# Altium schematic sheet backplane_main.SchDoc: Sample Sheet Title
size B; Date: MM/DD/YYYY; Author: Sample Author; Organization: ORGANIZATION; Address1: ADDRESS 1; Address2: ADDRESS 2; Address3: ADDRESS 3; Address4: ADDRESS 4; Revision: -; SheetNumber: 1; SheetTotal: 3; ENG_APP_DATE: --/--/--; DSN_APP_DATE: --/--/--; CHK_APP_DATE: --/--/--
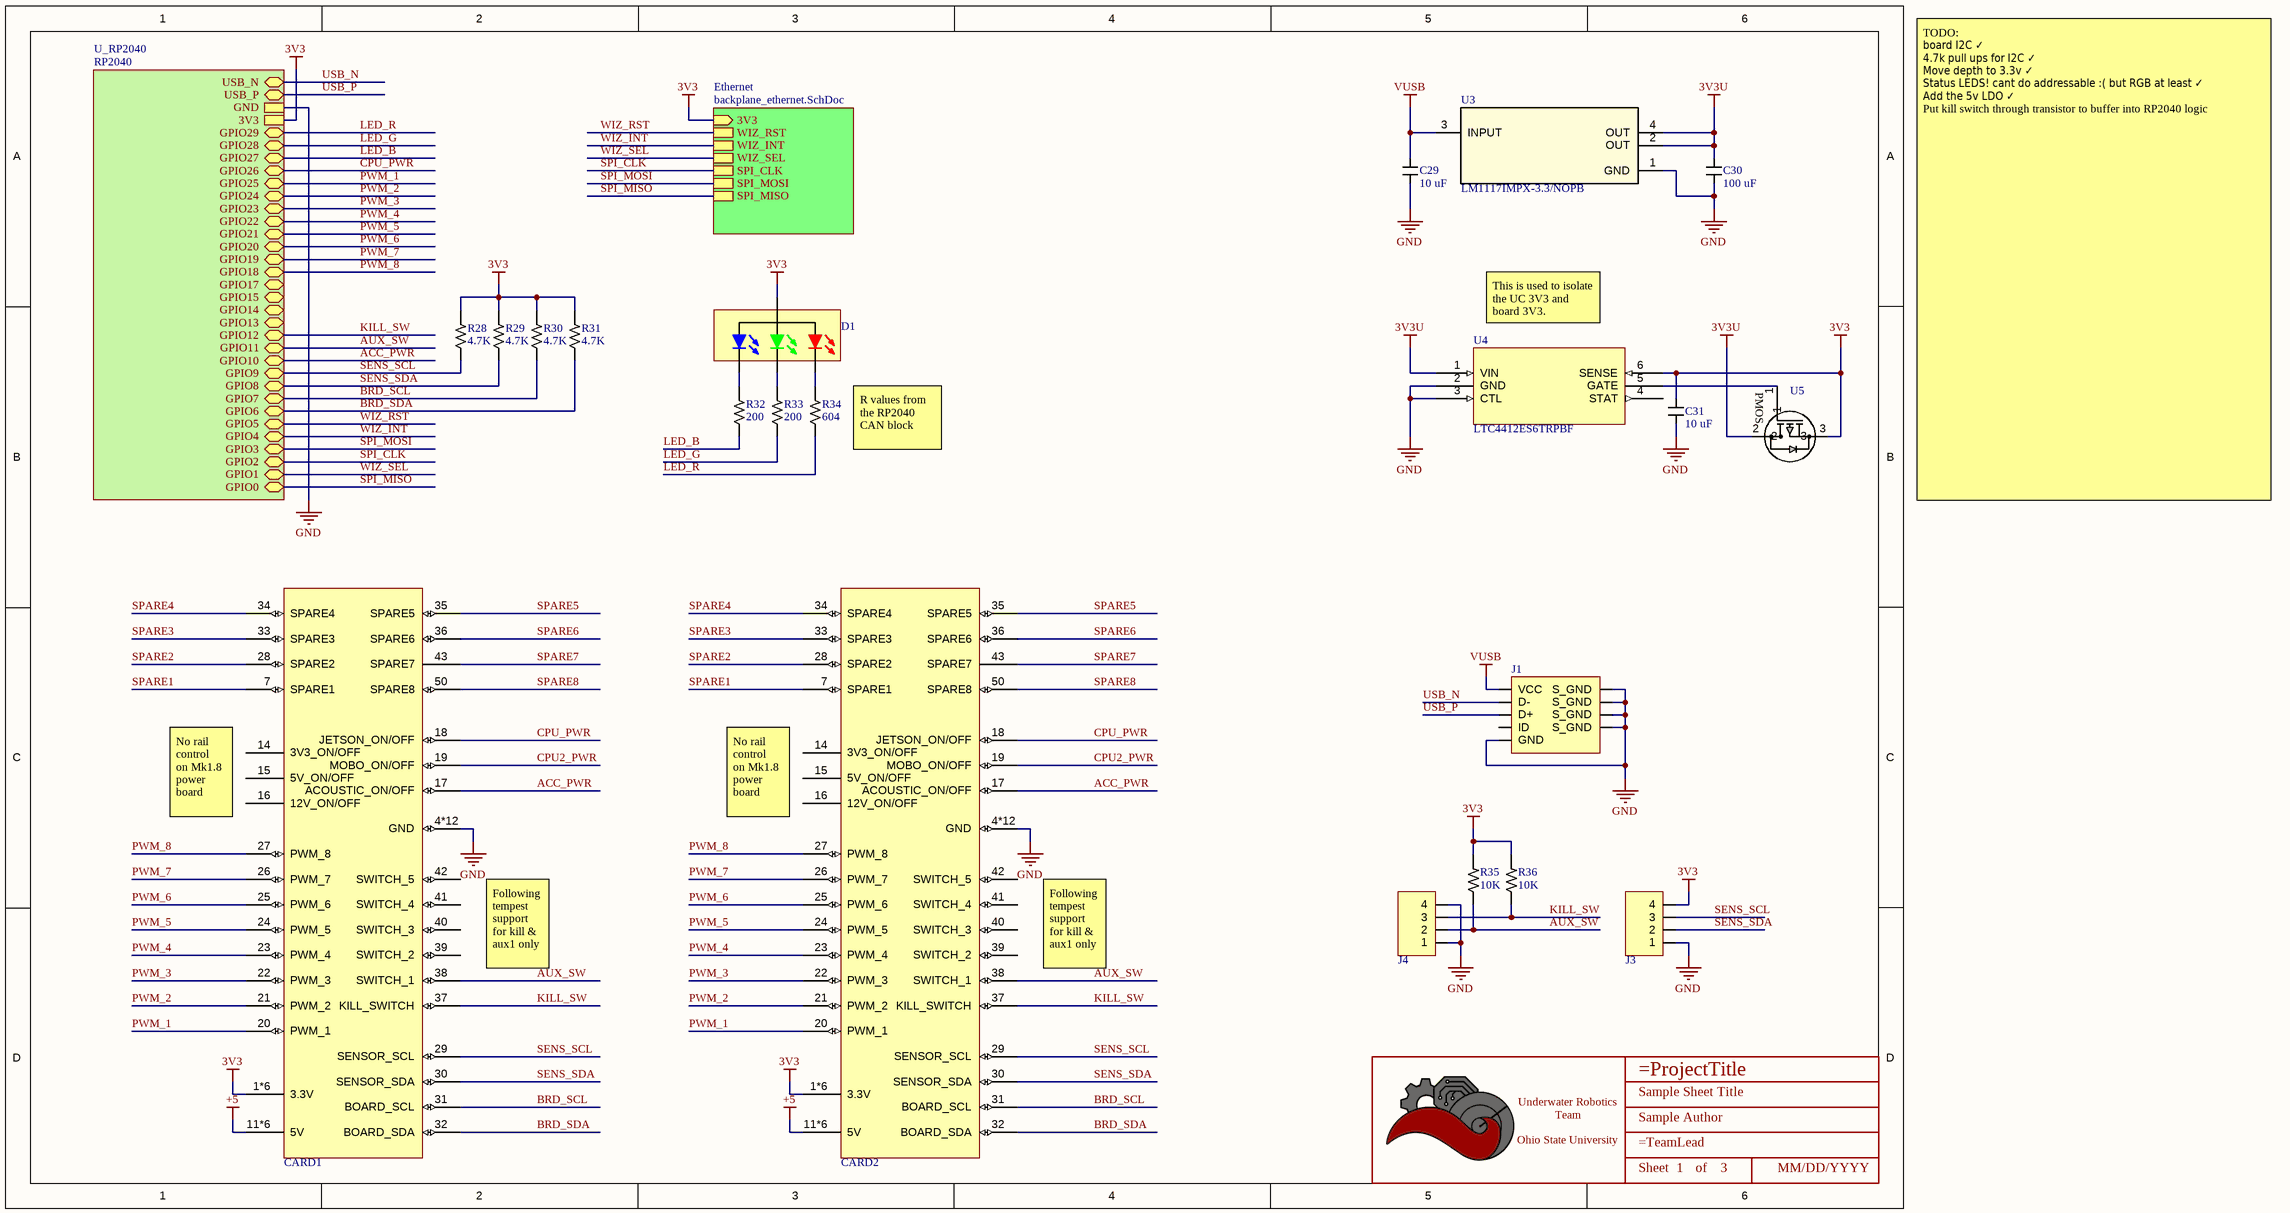
[diagram p0: backplane_main.SchDoc]

## Parts
*  Title_Block  [LOGO]  (value not drawn)  (graphical)
C29  Value (uF): 10 uF  [CAPACITOR_0603]  (hidden comment: 10uF Ceramic 6.3V)
C30  Value (uF): 100 uF  [CAPACITOR_0603]  (hidden comment: 100uF Ceramic 6.3V)
C31  Value (uF): 10 uF  [CAPACITOR_0603]  (hidden comment: 10uF Ceramic 6.3V)
CARD1  BACKPLANE_EDGE_SOCKET  [SOCKET_BACKPLANE_EDGE_CONN]  (value not drawn)
CARD2  BACKPLANE_EDGE_SOCKET  [SOCKET_BACKPLANE_EDGE_CONN]  (value not drawn)
D1  EAST1616RGBB4  [LED_0606_4SMD]  (value not drawn)
J1  USB_MICRO R/A  [CONN_MINIUSB]  (value not drawn)
J3  4 POS R/A  [CONN_MOLEX_MINIFIT JR_4 POS_R/A]  (value not drawn)
J4  4 POS R/A  [CONN_MOLEX_MINIFIT JR_4 POS_R/A]  (value not drawn)
R28  Value  (Ohms): 4.7K  [RESISTOR_0603]  (hidden comment: 10k Ohm 5% 1/10W)
R29  Value  (Ohms): 4.7K  [RESISTOR_0603]  (hidden comment: 10k Ohm 5% 1/10W)
R30  Value  (Ohms): 4.7K  [RESISTOR_0603]  (hidden comment: 10k Ohm 5% 1/10W)
R31  Value  (Ohms): 4.7K  [RESISTOR_0603]  (hidden comment: 10k Ohm 5% 1/10W)
R32  Value  (Ohms): 200  [RESISTOR_0603]  (hidden comment: 10k Ohm 5% 1/10W)
R33  Value  (Ohms): 200  [RESISTOR_0603]  (hidden comment: 10k Ohm 5% 1/10W)
R34  Value  (Ohms): 604  [RESISTOR_0603]  (hidden comment: 10k Ohm 5% 1/10W)
R35  Value  (Ohms): 10K  [RESISTOR_0603]  (hidden comment: 10k Ohm 5% 1/10W)
R36  Value  (Ohms): 10K  [RESISTOR_0603]  (hidden comment: 10k Ohm 5% 1/10W)
U3  LM1117IMPX-3.3/NOPB  [SOT-223-4]
U4  LTC4412ES6TRPBF  [TSOT-23_S6]
U5  MOSFET P-CHANNEL 20V 4.7A SOT23  [SOT-23-3]  (value not drawn)

## Sub-sheets
Ethernet = backplane_ethernet.SchDoc: WIZ_RST, WIZ_INT, WIZ_SEL, SPI_CLK, SPI_MOSI, SPI_MISO, 3V3 (in)
U_RP2040 = RP2040: GPIO0 (bidir), GPIO1 (bidir), GPIO2 (bidir), GPIO3 (bidir), GPIO4 (bidir), GPIO5 (bidir), GPIO6 (bidir), GPIO7 (bidir), GPIO8 (bidir), GPIO9 (bidir), GPIO10 (bidir), GPIO11 (bidir), GPIO12 (bidir), GPIO13 (bidir), GPIO14 (bidir), GPIO15 (bidir), GPIO17 (bidir), GPIO18 (bidir), GPIO19 (bidir), GPIO20 (bidir), GPIO21 (bidir), GPIO22 (bidir), GPIO23 (bidir), GPIO24 (bidir), GPIO25 (bidir), GPIO26 (bidir), GPIO27 (bidir), GPIO28 (bidir), GPIO29 (bidir), 3V3, GND, USB_P (bidir), USB_N (bidir)

## Nets
3V3: C31.1 CARD1.1*6(3.3V) CARD2.1*6(3.3V) D1.4 J3.4 R28.1 R29.1 R30.1 R31.1 R35.1 R36.1 U4.6(SENSE) U5.3 ; sheet U_RP2040/3V3, sheet Ethernet/3V3
3V3U: C30.1 U3.2(OUT) U3.4(OUT) U4.1(VIN) U5.2
+5: CARD1.11*6(5V) CARD2.11*6(5V)
GND: C29.2 C30.2 C31.2 CARD1.4*12(GND) CARD2.4*12(GND) J1.5(GND) J1.6(S_GND) J1.7(S_GND) J1.8(S_GND) J1.9(S_GND) J3.1 J4.1 J4.4 U3.1(GND) U4.2(GND) U4.3(CTL) ; sheet U_RP2040/GND
VUSB: C29.1 J1.1(VCC) U3.3(INPUT)
ACC_PWR: CARD1.17(ACOUSTIC_ON/OFF) CARD2.17(ACOUSTIC_ON/OFF) ; sheet U_RP2040/GPIO10
AUX_SW: CARD1.38(SWITCH_1) CARD2.38(SWITCH_1) J4.2 R35.2 ; sheet U_RP2040/GPIO11
BRD_SCL: CARD1.31(BOARD_SCL) CARD2.31(BOARD_SCL) R30.2 ; sheet U_RP2040/GPIO7
BRD_SDA: CARD1.32(BOARD_SDA) CARD2.32(BOARD_SDA) R31.2 ; sheet U_RP2040/GPIO6
CPU2_PWR: CARD1.19(MOBO_ON/OFF) CARD2.19(MOBO_ON/OFF)
CPU_PWR: CARD1.18(JETSON_ON/OFF) CARD2.18(JETSON_ON/OFF) ; sheet U_RP2040/GPIO26
KILL_SW: CARD1.37(KILL_SWITCH) CARD2.37(KILL_SWITCH) J4.3 R36.2 ; sheet U_RP2040/GPIO12
LED_B: R32.2 ; sheet U_RP2040/GPIO27
LED_G: R33.2 ; sheet U_RP2040/GPIO28
LED_R: R34.2 ; sheet U_RP2040/GPIO29
PWM_1: CARD1.20(PWM_1) CARD2.20(PWM_1) ; sheet U_RP2040/GPIO25
PWM_2: CARD1.21(PWM_2) CARD2.21(PWM_2) ; sheet U_RP2040/GPIO24
PWM_3: CARD1.22(PWM_3) CARD2.22(PWM_3) ; sheet U_RP2040/GPIO23
PWM_4: CARD1.23(PWM_4) CARD2.23(PWM_4) ; sheet U_RP2040/GPIO22
PWM_5: CARD1.24(PWM_5) CARD2.24(PWM_5) ; sheet U_RP2040/GPIO21
PWM_6: CARD1.25(PWM_6) CARD2.25(PWM_6) ; sheet U_RP2040/GPIO20
PWM_7: CARD1.26(PWM_7) CARD2.26(PWM_7) ; sheet U_RP2040/GPIO19
PWM_8: CARD1.27(PWM_8) CARD2.27(PWM_8) ; sheet U_RP2040/GPIO18
SENS_SCL: CARD1.29(SENSOR_SCL) CARD2.29(SENSOR_SCL) J3.3 R28.2 ; sheet U_RP2040/GPIO9
SENS_SDA: CARD1.30(SENSOR_SDA) CARD2.30(SENSOR_SDA) J3.2 R29.2 ; sheet U_RP2040/GPIO8
SPARE1: CARD1.7(SPARE1) CARD2.7(SPARE1)
SPARE2: CARD1.28(SPARE2) CARD2.28(SPARE2)
SPARE3: CARD1.33(SPARE3) CARD2.33(SPARE3)
SPARE4: CARD1.34(SPARE4) CARD2.34(SPARE4)
SPARE5: CARD1.35(SPARE5) CARD2.35(SPARE5)
SPARE6: CARD1.36(SPARE6) CARD2.36(SPARE6)
SPARE7: CARD1.43(SPARE7) CARD2.43(SPARE7)
SPARE8: CARD1.50(SPARE8) CARD2.50(SPARE8)
SPI_CLK: sheet U_RP2040/GPIO2, sheet Ethernet/SPI_CLK
SPI_MISO: sheet U_RP2040/GPIO0, sheet Ethernet/SPI_MISO
SPI_MOSI: sheet U_RP2040/GPIO3, sheet Ethernet/SPI_MOSI
USB_N: J1.2(D-) ; sheet U_RP2040/USB_N
USB_P: J1.3(D+) ; sheet U_RP2040/USB_P
WIZ_INT: sheet U_RP2040/GPIO4, sheet Ethernet/WIZ_INT
WIZ_RST: sheet U_RP2040/GPIO5, sheet Ethernet/WIZ_RST
WIZ_SEL: sheet U_RP2040/GPIO1, sheet Ethernet/WIZ_SEL
NetD1_1: D1.1 R34.1
NetD1_2: D1.2 R33.1
NetD1_3: D1.3 R32.1
NetU4_5: U4.5(GATE) U5.1

Not connected (* = marked no-connect by the designer): CARD1 14(3V3_ON/OFF) 15(5V_ON/OFF) 16(12V_ON/OFF) 39(SWITCH_2) 40(SWITCH_3) 41(SWITCH_4) 42(SWITCH_5); CARD2 14(3V3_ON/OFF) 15(5V_ON/OFF) 16(12V_ON/OFF) 39(SWITCH_2) 40(SWITCH_3) 41(SWITCH_4) 42(SWITCH_5); J1 4(ID); U4 4(STAT)

## Notes on the sheet
- This is used to isolate the UC 3V3 and board 3V3.
- R values from the RP2040 CAN block
- TODO:
  board I2C ✓
  4.7k pull ups for I2C ✓
  Move depth to 3.3v ✓
  Status LEDS! cant do addressable :( but RGB at least ✓
  Add the 5v LDO ✓
  Put kill switch through transistor to buffer into RP2040 logic
- No rail control
  on Mk1.8 power board
- Following tempest support for kill & aux1 only
- DWG. NO.
- REV.
- SHT.
- THIS DOCUMENT AND THE DATA DISCLOSED HEREIN OR HEREWITH IS THE PROPERTY OF ALTIUM LIMITED AND MAY BE FREELY DISTRIBUTED IN WHOLE. NO RIGHTS ARE RESERVED OR EXPRESS OR IMPLIED WARANTEE GIVEN.
- REVISION
- DESCRIPTION
- DATE
- APPROVED
- ENG:
- APPROVALS
- PROJECT
- DSN:
- CHK:
- REFERENCE DOCUMENTS
- PROJECT REVISION:
- TITLE
- DOCUMENT REVISION:
- DESIGN ITEM:
- BOM:
- FAB DWG:
- PCB DWG:
- ASSY DWG:
- SCALE:
- SIZE
- B
- CAGE CODE
- FILE NAME
- DWG NO.
- SHEET
- OF
- REV
- (in symbol Title_Block) Underwater Robotics Team / Ohio State University; Sheet; of
- (in symbol TSM500P02CX) PMOS

## Library data of the parts
* = Title_Block: UWRT Schematic Title Block Template / Created June 2021, Dylan Trainor
C29 C31 = CAPACITOR_10uF_0603: Cap 10uF 6.3V +/-20% / Ceramic 0603; Made By: Flip B; ComponentLink1Description: Digikey; ComponentLink1URL: https://www.digikey.com/en/products/detail/samsung-electro-mechanics/CL10A106MQ8NNNC/3886777; Supplier 1: Digi-Key; Supplier Part Number 1: 1276-1119-1-ND; Tolerance: +/- 20%; Voltage: 6.3V
C30 = CAPACITOR_100uF_0603: Cap 100uF 6.3V +/-20% / Ceramic 0603; Made By: Dylan Trainor; ComponentLink1Description: Digikey; ComponentLink1URL: https://www.digikey.com/en/products/detail/samsung-electro-mechanics/CL10A106MQ8NNNC/3886777; Tolerance: +/- 20%; Voltage: 6.3V; Supplier 1: RSComponents; Supplier Part Number 1: 6911206
CARD1 CARD2 = BACKPLANE_EDGE_SOCKET: Backplane Edge Socket; pin to pad: 1*6>1+2+3+54+55+56 4*12>4+5+6+8+9+10+47+48+49+51+52+53 11*6>11+12+13+44+45+46; Made By: Robert Pafford; Supplier 1: Digi-Key; Supplier Part Number 1: A31719-ND
D1 = LED_RGB_4SMD: LED RGB CLEAR 4SMD; Made By: Robert Pafford; Red Forward Voltage: 1.8V; Red Forward Current: 5mA; Green Forward Voltage: 2.8V; ComponentLink1Description: Datasheet; ComponentLink1URL: https://everlightamericas.com/index.php?controller=attachment&id_attachment=3220; Package: 4-SMD; Green Forward Current: 5mA; Blue Forward Voltage: 2.8V; Blue Forward Current: 5mA; Color: RGB; Supplier 1: Digi-Key; Supplier Part Number 1: 1080-1552-1-ND
J1 = CONN_MICROUSB: Amphenol Micro USB-B / USB2.0 5 Pin Right Angle SMD; Pitch: 0.65mm; Current Per Pin: 1.8A; Number of Positions: 5; Manufacturer: Amphenol; Configuration: Right Angle; Color: Silver; Created By: Flip B; ComponentLink1Description: Datasheet; ComponentLink1URL: https://cdn.amphenol-icc.com/media/wysiwyg/files/documentation/datasheet/inputoutput/io_usb_micro.pdf?__cf_chl_jschl_tk__=05693735e19256298f6ef6ca2bb2e65c376a4f56-1625503833-0-Abitsb0-ufjOXJYs_S3J3r2iTn-nObalbmXUksF1VvO_h_WEmRdMlUD1I8-hmWSEVWzY1pirKnrPZWfgY3851qyBZe5ZvnNQePLGIzUgdEIQBVUyW36RsbYpDLEWxJ4horD-5gChFgobLYqwmG5aHl0E8lIn_twwPPrOxilK2gP0q9t_CNOs_u5fMqXvXUrlsOv8tIE2NRlu6NVP8qtkL2GjhlkeTUbDMF8WvvpPDTFOgvZ4Y16Ej8F8AhWos88mo5B1HssXozw0XrkJQIqERITUu6rqloz9kf4ZzhBHtDAt-IkiAFY_Ds9SW8FYKKTtINJVpHZQ6Gyu1FFM4Dc9MO0maE8_mmNcwlxqyRoRk_MPWW8VyByXWM5RSp52jteRKw7FeI9WIYvCbPAOy0Eyib-aseIQsnGbglBcUY6_2xp8GYaJM38H3dNvBPsSOfJBPndKedwKHllxjkucXn6xsN0sDXkpGN-cu8_2bDTJ0g-uUucKSCooYX-ApSDNGpkA_p9zv1SOAD8c0zaZVmtiBsN75QpVz2rzq9_BFxOywPvR; Series: 10118192; Supplier 1: Digi-Key; Supplier Part Number 1: 609-4613-1-ND
J3 J4 = CONN_MOLEX_MINIFIT JR_4POS_R/A: Molex Minifit Jr. 5569 / 4 Pos R/A Natural; Pitch: 4.2mm; Configuration: Right Angle; Current Per Pin: 13A; Number of Positions: 4; Supplier Part Number 1: WM13112-ND; Supplier 1: Digi-Key; Manufacturer: Molex; Color: Natural; Created By: Flip B; ComponentLink1Description: Datasheet; ComponentLink1URL: https://www.molex.com/pdm_docs/sd/026013115_sd.pdf; Series: Minifit Jr 5569
R28-R36 = RESISTOR_10K_0603: RES 10k OHM 5% 1/10W 0603; Tolerance: +/- 5%; Wattage: 1/8W; Made By: Robert Pafford; ComponentLink1Description: Datasheet; ComponentLink1URL: https://www.bourns.com/docs/product-datasheets/CRxxxxx.pdf; Supplier: Digikey; Digikey Part Numer: CR0603-JW-104ELFTR-ND; Supplier 1: Digi-Key; Supplier Part Number 1: 2019-RK73B1JTTD103JCT-ND
U3 = LM1117IMPX-3.3/NOPB: IC REG LIN 3.3V 800MA SOT223-4; PartNumber: LM1117IMP-3.3/NOPB; Manufacturer: Texas Instruments; Vin (Max): 15V; Supplier 1: Digi-Key; Supplier Part Number 1: LM1117IMPX-3.3/NOPBCT-ND; Vout (Min/Fixed): 3.3V; Amp Out: 800mA; Package: SOT-223-4; Created By: Dylan T
U4 = LTC4412ES6TRPBF: OR Controller Source Selector Switch P-Channel 2:1 TSOT-23-6; MP: LTC4412ES6#TRPBF; MF: Analog Devices; Price: None; Availability: Good; Mouser-Purchase-URL: https://snapeda.com/shop?store=Mouser&id=4343773; Arrow_Europe-Purchase-URL: https://snapeda.com/shop?store=Arrow+Europe&id=4343773; DigiKey-Purchase-URL: https://snapeda.com/shop?store=DigiKey&id=4343773; Package: SOT-23-6 Analog Devices; SnapEDA_Link: https://www.snapeda.com/parts/LTC4412ES6%23TRPBF/Analog%20Devices/view-part/4343773/?ref=snap; Value: *; Check_prices: https://www.snapeda.com/parts/LTC4412ES6%23TRPBF/Analog%20Devices/view-part/4343773/?ref=eda
U5 = TSM500P02CX: P-Channel 20 V 4.7A (Tc) 1.56W (Tc) Surface Mount SOT-23; Vendor: Taiwan Semiconductor Corporation; Vgs (Max): ±10V; Vgs (th): 800mV @ 250µA; Rds (on): 50mOhm @ 3A, 4.5V; Amp Rating: 4.7 A; FET Type: P-Channel; Package: TO-236-3, SC-59, SOT-23-3; Manufacturer_Part_Number: TSM500P02CX; Vdss: 20 V; Power Dissipation: 1.56W (Tc); Created By: Robert Pafford; Supplier 1: Digi-Key; Supplier Part Number 1: TSM500P02CXRFGCT-ND